# Altium schematic sheet utility.SchDoc
size A
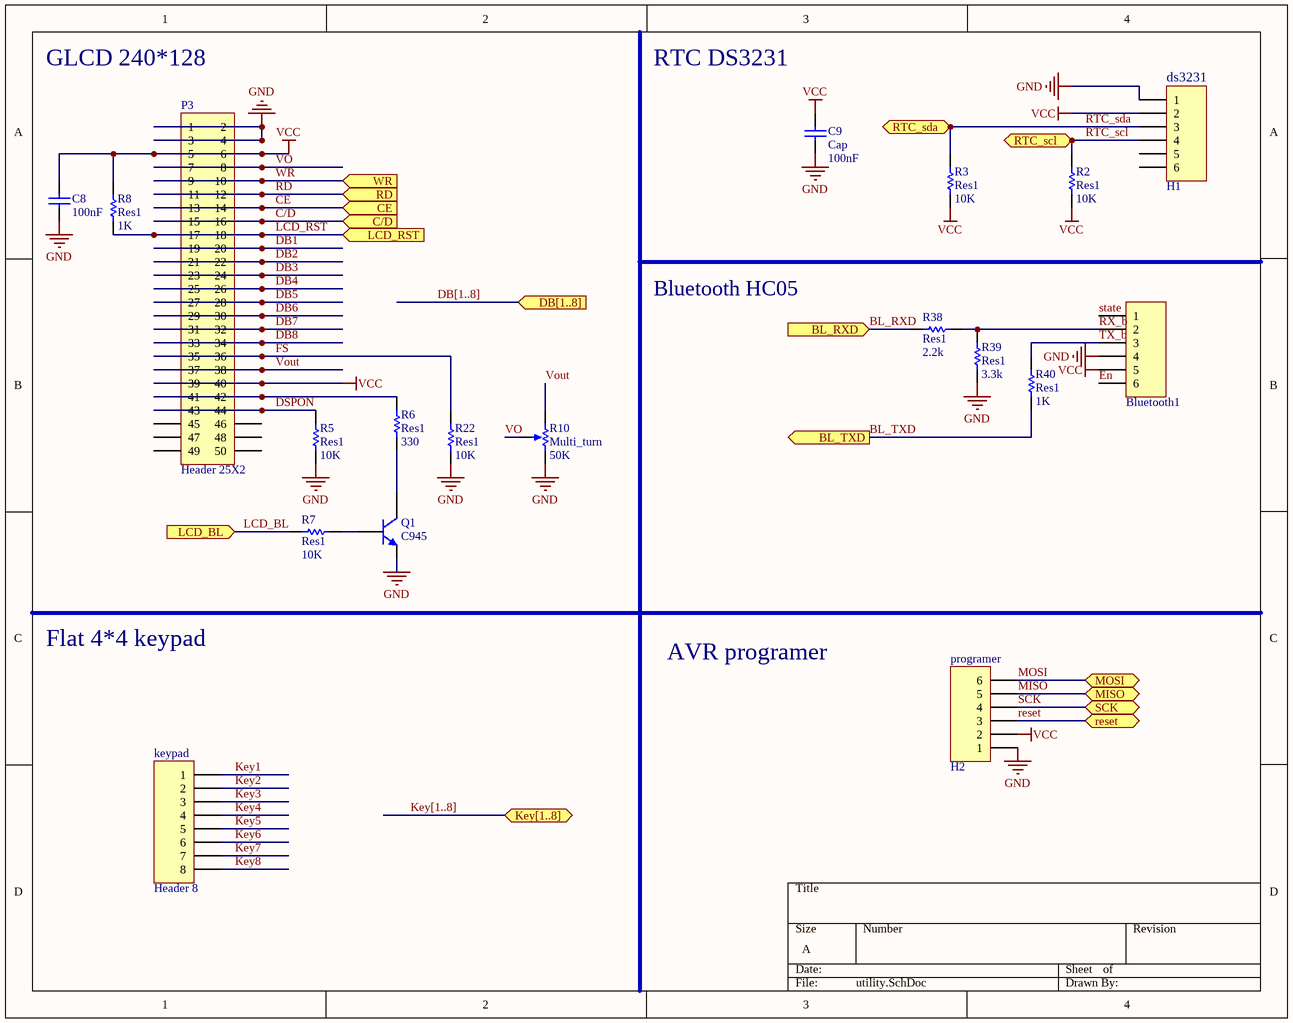
[diagram p0: utility.SchDoc]

## Parts
Bluetooth1  H-1x6  [H-1x6]  (value not drawn)
C8  value 100nF  [CAP 1206 (3216X15L)]  (hidden comment: Cap)
C9  Cap  value 100nF  [CAP 1206 (3216X15L)]
H1  H-1x6  [ds3231]  (value not drawn)
H2  programer  [HDR1X6]
keypad  Header 8  [HDR1X8]
P3  Header 25X2  [HDR2X25]
Q1  C945  [SOT23_N]
R2  Res1  value 10K  [RES 1206 (3216X08L)]
R3  Res1  value 10K  [RES 1206 (3216X08L)]
R5  Res1  value 10K  [RES 1206 (3216X08L)]
R6  Res1  value 330  [RES 1206 (3216X08L)]
R7  Res1  value 10K  [RES 1206 (3216X08L)]
R8  Res1  value 1K  [RES 1206 (3216X08L)]
R10  Multi_turn  value 50K  [Multi Turn 02]
R22  Res1  value 10K  [RES 1206 (3216X08L)]
R38  Res1  value 2.2k  [RES 1206 (3216X08L)]
R39  Res1  value 3.3k  [RES 1206 (3216X08L)]
R40  Res1  value 1K  [RES 1206 (3216X08L)]

## Ports
BL_RXD (in), BL_TXD (out), C/D (in), CE (in), DB[1..8] (in), Key[1..8] (bidir), LCD_BL (in), LCD_RST (in), MISO (bidir), MOSI (bidir), RD (in), reset (bidir), RTC_scl (bidir), RTC_sda (bidir), SCK (bidir), WR (in)

## Nets
GND: Bluetooth1.4 C8.1 C9.1 H1.1 H2.1 P3.1 P3.2 P3.3 P3.4 Q1.2(E) R5.1 R10.2(BOT) R22.1 R39.1
VCC: Bluetooth1.5 C8.2 C9.2 H1.2 H2.2 P3.5 P3.6 P3.39 P3.40 R2.1 R3.1 R8.1
BL_RXD: R38.1 ; port BL_RXD
BL_TXD: R40.2 ; port BL_TXD
C/D: P3.15 P3.16 ; port C/D
CE: P3.13 P3.14 ; port CE
DB1: P3.19 P3.20
DB2: P3.21 P3.22
DB3: P3.23 P3.24
DB4: P3.25 P3.26
DB5: P3.27 P3.28
DB6: P3.29 P3.30
DB7: P3.31 P3.32
DB8: P3.33 P3.34
DSPON: P3.43 P3.44 R5.2
En: Bluetooth1.6
FS: P3.35 P3.36 R22.2
Key1: keypad.1
Key2: keypad.2
Key3: keypad.3
Key4: keypad.4
Key5: keypad.5
Key6: keypad.6
Key7: keypad.7
Key8: keypad.8
LCD_BL: R7.2 ; port LCD_BL
LCD_RST: P3.17 P3.18 R8.2 ; port LCD_RST
MISO: H2.5 ; port MISO
MOSI: H2.6 ; port MOSI
RD: P3.11 P3.12 ; port RD
reset: H2.3 ; port reset
RTC_scl: H1.4 R2.2 ; port RTC_scl
RTC_sda: H1.3 R3.2 ; port RTC_sda
RX_b: Bluetooth1.2 R38.2 R39.2
SCK: H2.4 ; port SCK
state: Bluetooth1.1
TX_b: Bluetooth1.3 R40.1
VO: P3.7 P3.8 R10.3(TAP)
Vout: P3.37 P3.38 R10.1(TOP)
WR: P3.9 P3.10 ; port WR
NetP3_41: P3.41 P3.42 R6.2
NetQ1_1: Q1.1(B) R7.1
NetQ1_3: Q1.3(C) R6.1

Not connected (* = marked no-connect by the designer): H1 5 6; P3 45 46 47 48 49 50

## Buses and harness runs
bus DB[1..8] = port DB[1..8]
bus Key[1..8] = port Key[1..8]

## Notes on the sheet
- GLCD 240*128
- RTC DS3231
- (near H1) ds3231
- Bluetooth HC05
- Flat 4*4 keypad
- AVR programer

## Library data of the parts
C8 C9 = Cap ceramic: CAP-100Nf
H2 = H-1x6
keypad = Header 8: Header, 8-Pin; LatestRevisionDate: 17-Jul-2002; LatestRevisionNote: Re-released for DXP Platform.; Publisher: Altium Limited
P3 = Header 25X2: Header, 25-Pin, Dual row; LatestRevisionDate: 17-Jul-2002; LatestRevisionNote: Re-released for DXP Platform.; Publisher: Altium Limited
Q1 = C945: NPN Silicon Epitaxial Planar Transistor; Published: 2017-2-8; LatestRevisionDate: 2017; LatestRevisionNote: IPC-7351 Footprint Added.; DatasheetVersion: 2017; PackageVersion: 2017-2-8; PackageReference: SOT23; Publisher: Abbas Basereh; PackageDescription: 3-Pin SOT-23 Package 0.95 mm Pitch, 2.3 mm Lead Span; ComponentLink1Description: Manufacturer Link; ComponentLink1URL: http://www.taitroncomponents.com/; ComponentLink2Description: Datasheet; ComponentLink2URL: http://www.taitroncomponents.com/
R2 R3 R5-R8 R22 R38-R40 = Res1: Resistor; Published: 8-Jun-2000; LatestRevisionDate: 17-Jul-2002; LatestRevisionNote: Re-released for DXP Platform.; Publisher: Altium Limited; PackageDescription: Axial Device, Thru-Hole; 2 Leads; 0.3 in Pin Spacing
  R2 R3: PackageReference: RES 1206 (3216X08L)
  R5-R8 R22 R38-R40: PackageReference: AXIAL-0.3
R10 = Multi_turn: Potentiometer; Sim Note: Enter the Resistance value and the set point into parameter fields.; Set Position: 0.5; Published: 8-Jun-2000; LatestRevisionDate: 17-Jul-2002; LatestRevisionNote: Re-released for DXP Platform.; PackageReference: VR5; Publisher: Altium Limited